# Altium schematic sheet Lights.SchDoc: RGB LEDS
size Letter; Author: Parth Thakkar; CompanyName: Insane Corp; DrawnBy: Parth Thakkar; Engineer: Parth Thakkar; Organization: Low Self Esteem; Revision: v1.0; SheetNumber: 8; SheetTotal: 8
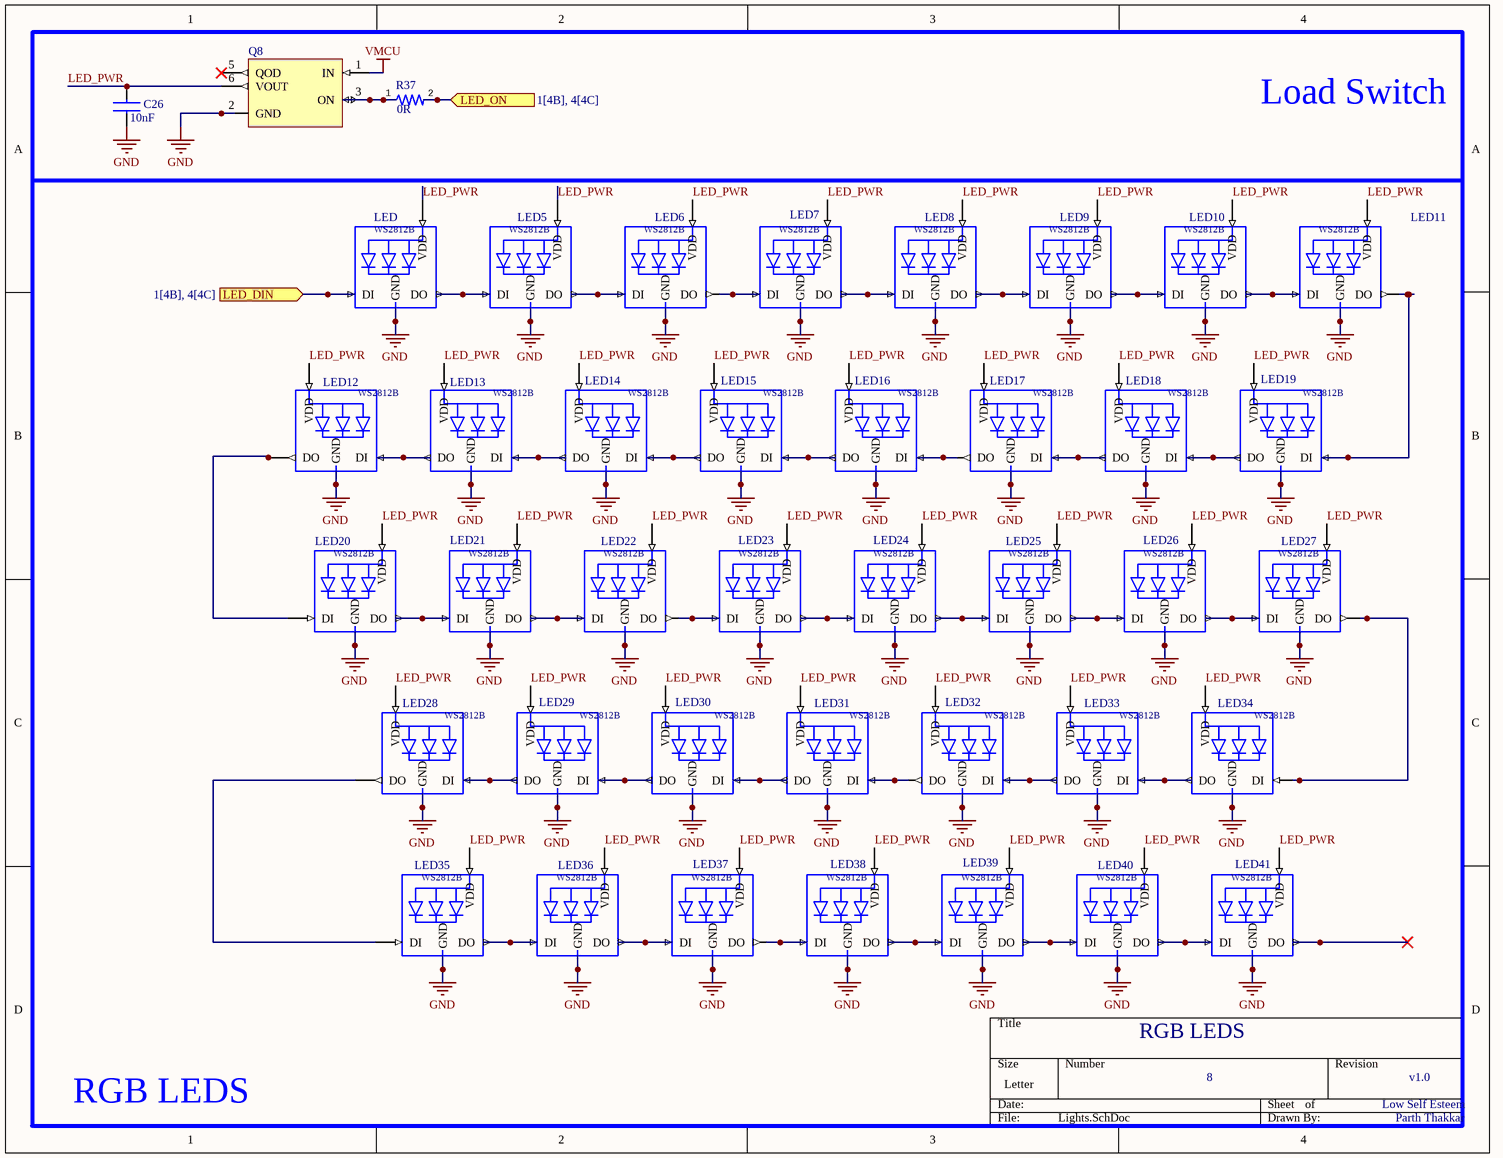
[diagram p0: Lights.SchDoc]

## Parts
C26  value 10nF  [Capacitor 0603]  (hidden comment: CAP 0.1uF 100V 0603)
LED  WS2812B  [WS2812B]  (value not drawn)
LED5  WS2812B  [WS2812B]  (value not drawn)
LED6  WS2812B  [WS2812B]  (value not drawn)
LED7  WS2812B  [WS2812B]  (value not drawn)
LED8  WS2812B  [WS2812B]  (value not drawn)
LED9  WS2812B  [WS2812B]  (value not drawn)
LED10  WS2812B  [WS2812B]  (value not drawn)
LED11  WS2812B  [WS2812B]  (value not drawn)
LED12  WS2812B  [WS2812B]  (value not drawn)
LED13  WS2812B  [WS2812B]  (value not drawn)
LED14  WS2812B  [WS2812B]  (value not drawn)
LED15  WS2812B  [WS2812B]  (value not drawn)
LED16  WS2812B  [WS2812B]  (value not drawn)
LED17  WS2812B  [WS2812B]  (value not drawn)
LED18  WS2812B  [WS2812B]  (value not drawn)
LED19  WS2812B  [WS2812B]  (value not drawn)
LED20  WS2812B  [WS2812B]  (value not drawn)
LED21  WS2812B  [WS2812B]  (value not drawn)
LED22  WS2812B  [WS2812B]  (value not drawn)
LED23  WS2812B  [WS2812B]  (value not drawn)
LED24  WS2812B  [WS2812B]  (value not drawn)
LED25  WS2812B  [WS2812B]  (value not drawn)
LED26  WS2812B  [WS2812B]  (value not drawn)
LED27  WS2812B  [WS2812B]  (value not drawn)
LED28  WS2812B  [WS2812B]  (value not drawn)
LED29  WS2812B  [WS2812B]  (value not drawn)
LED30  WS2812B  [WS2812B]  (value not drawn)
LED31  WS2812B  [WS2812B]  (value not drawn)
LED32  WS2812B  [WS2812B]  (value not drawn)
LED33  WS2812B  [WS2812B]  (value not drawn)
LED34  WS2812B  [WS2812B]  (value not drawn)
LED35  WS2812B  [WS2812B]  (value not drawn)
LED36  WS2812B  [WS2812B]  (value not drawn)
LED37  WS2812B  [WS2812B]  (value not drawn)
LED38  WS2812B  [WS2812B]  (value not drawn)
LED39  WS2812B  [WS2812B]  (value not drawn)
LED40  WS2812B  [WS2812B]  (value not drawn)
LED41  WS2812B  [WS2812B]  (value not drawn)
Q8  TPS22919  [TPS22919DCKR - Load SW]  (value not drawn)
R37  value 0R  [Resistor 0402]  (hidden comment: RES 0R 0402)

## Blocks framed on the sheet
RGB LEDS: LED LED5-LED41

## Ports
LED_DIN (in, see 1[4B], 4[4C]), LED_ON (in, see 1[4B], 4[4C])

## Nets
GND: C26.1 LED.3-GND(GND) LED5.3-GND(GND) LED6.3-GND(GND) LED7.3-GND(GND) LED8.3-GND(GND) LED9.3-GND(GND) LED10.3-GND(GND) LED11.3-GND(GND) LED12.3-GND(GND) LED13.3-GND(GND) LED14.3-GND(GND) LED15.3-GND(GND) LED16.3-GND(GND) LED17.3-GND(GND) LED18.3-GND(GND) LED19.3-GND(GND) LED20.3-GND(GND) LED21.3-GND(GND) LED22.3-GND(GND) LED23.3-GND(GND) LED24.3-GND(GND) LED25.3-GND(GND) LED26.3-GND(GND) LED27.3-GND(GND) LED28.3-GND(GND) LED29.3-GND(GND) LED30.3-GND(GND) LED31.3-GND(GND) LED32.3-GND(GND) LED33.3-GND(GND) LED34.3-GND(GND) LED35.3-GND(GND) LED36.3-GND(GND) LED37.3-GND(GND) LED38.3-GND(GND) LED39.3-GND(GND) LED40.3-GND(GND) LED41.3-GND(GND) Q8.2(GND)
VMCU: Q8.1(IN)
LED_DIN: LED.4-DIN(DI) ; port LED_DIN
LED_ON: R37.2 ; port LED_ON
LED_PWR: C26.2 LED.1-VDD(VDD) LED5.1-VDD(VDD) LED6.1-VDD(VDD) LED7.1-VDD(VDD) LED8.1-VDD(VDD) LED9.1-VDD(VDD) LED10.1-VDD(VDD) LED11.1-VDD(VDD) LED12.1-VDD(VDD) LED13.1-VDD(VDD) LED14.1-VDD(VDD) LED15.1-VDD(VDD) LED16.1-VDD(VDD) LED17.1-VDD(VDD) LED18.1-VDD(VDD) LED19.1-VDD(VDD) LED20.1-VDD(VDD) LED21.1-VDD(VDD) LED22.1-VDD(VDD) LED23.1-VDD(VDD) LED24.1-VDD(VDD) LED25.1-VDD(VDD) LED26.1-VDD(VDD) LED27.1-VDD(VDD) LED28.1-VDD(VDD) LED29.1-VDD(VDD) LED30.1-VDD(VDD) LED31.1-VDD(VDD) LED32.1-VDD(VDD) LED33.1-VDD(VDD) LED34.1-VDD(VDD) LED35.1-VDD(VDD) LED36.1-VDD(VDD) LED37.1-VDD(VDD) LED38.1-VDD(VDD) LED39.1-VDD(VDD) LED40.1-VDD(VDD) LED41.1-VDD(VDD) Q8.6(VOUT)
NetLED5_2-DOUT: LED5.2-DOUT(DO) LED6.4-DIN(DI)
NetLED6_2-DOUT: LED6.2-DOUT(DO) LED7.4-DIN(DI)
NetLED7_2-DOUT: LED7.2-DOUT(DO) LED8.4-DIN(DI)
NetLED8_2-DOUT: LED8.2-DOUT(DO) LED9.4-DIN(DI)
NetLED9_2-DOUT: LED9.2-DOUT(DO) LED10.4-DIN(DI)
NetLED10_2-DOUT: LED10.2-DOUT(DO) LED11.4-DIN(DI)
NetLED11_2-DOUT: LED11.2-DOUT(DO) LED19.4-DIN(DI)
NetLED12_2-DOUT: LED12.2-DOUT(DO) LED20.4-DIN(DI)
NetLED12_4-DIN: LED12.4-DIN(DI) LED13.2-DOUT(DO)
NetLED13_4-DIN: LED13.4-DIN(DI) LED14.2-DOUT(DO)
NetLED14_4-DIN: LED14.4-DIN(DI) LED15.2-DOUT(DO)
NetLED15_4-DIN: LED15.4-DIN(DI) LED16.2-DOUT(DO)
NetLED16_4-DIN: LED16.4-DIN(DI) LED17.2-DOUT(DO)
NetLED17_4-DIN: LED17.4-DIN(DI) LED18.2-DOUT(DO)
NetLED18_4-DIN: LED18.4-DIN(DI) LED19.2-DOUT(DO)
NetLED20_2-DOUT: LED20.2-DOUT(DO) LED21.4-DIN(DI)
NetLED21_2-DOUT: LED21.2-DOUT(DO) LED22.4-DIN(DI)
NetLED22_2-DOUT: LED22.2-DOUT(DO) LED23.4-DIN(DI)
NetLED23_2-DOUT: LED23.2-DOUT(DO) LED24.4-DIN(DI)
NetLED24_2-DOUT: LED24.2-DOUT(DO) LED25.4-DIN(DI)
NetLED25_2-DOUT: LED25.2-DOUT(DO) LED26.4-DIN(DI)
NetLED26_2-DOUT: LED26.2-DOUT(DO) LED27.4-DIN(DI)
NetLED27_2-DOUT: LED27.2-DOUT(DO) LED34.4-DIN(DI)
NetLED28_2-DOUT: LED28.2-DOUT(DO) LED35.4-DIN(DI)
NetLED28_4-DIN: LED28.4-DIN(DI) LED29.2-DOUT(DO)
NetLED29_4-DIN: LED29.4-DIN(DI) LED30.2-DOUT(DO)
NetLED30_4-DIN: LED30.4-DIN(DI) LED31.2-DOUT(DO)
NetLED31_4-DIN: LED31.4-DIN(DI) LED32.2-DOUT(DO)
NetLED32_4-DIN: LED32.4-DIN(DI) LED33.2-DOUT(DO)
NetLED33_4-DIN: LED33.4-DIN(DI) LED34.2-DOUT(DO)
NetLED35_2-DOUT: LED35.2-DOUT(DO) LED36.4-DIN(DI)
NetLED36_2-DOUT: LED36.2-DOUT(DO) LED37.4-DIN(DI)
NetLED37_2-DOUT: LED37.2-DOUT(DO) LED38.4-DIN(DI)
NetLED38_2-DOUT: LED38.2-DOUT(DO) LED39.4-DIN(DI)
NetLED39_2-DOUT: LED39.2-DOUT(DO) LED40.4-DIN(DI)
NetLED40_2-DOUT: LED40.2-DOUT(DO) LED41.4-DIN(DI)
NetLED_2-DOUT: LED.2-DOUT(DO) LED5.4-DIN(DI)
NetQ8_3: Q8.3(ON) R37.1

Not connected (* = marked no-connect by the designer): LED41 2-DOUT(DO)*; Q8 5(QOD)*

## Notes on the sheet
- Load Switch

## Library data of the parts
C26 = CAP 0.1uF 100V 0603: Ceramic Capacitor, Multilayer, Ceramic, 100V, 10% +Tol, 10% -Tol, X7R, 15% TC, 0.01uF, Surface Mount, 0603; Manufacturer: Murata; Manufacturer Part Number: GCM188R72A103KA37D; Multilayer: Yes; Reference Standard: AEC-Q200; Supplier: Digikey; Supplier Part Number: 490-4781-2-ND; RoHS: Yes; Category: Ceramic Capacitors; Stock: 6260000; Pricing: 4000=0.00978, 8000=0.00881, 12000=0.00833, 20000=0.00779, 28000=0.00747, 40000=0.00716, 100000=0.0065, 200000=0.00638 (USD); Mounting Technology: Surface Mount; Pins: 2; Dielectric Material: Ceramic; Package Shape: Rectangular; Case/Package: 0603; Terminal Finish: Nickel; Min Operating Temperature: -55°C; Max Operating Temperature: 125°C; JESD-609 Code: e3; Capacitor Type: Ceramic; Tolerance  (fill in as +-): 10%; Package Style: SMTMeter; Packaging: Tape and Reel; Tolerance (fill in as +-): 10%; Rated DC Voltage (URdc): 100V; Temperature Characteristics Code: X7R; Termination: Wraparound; Length: 1.6mm; Width: 0.8mm; Height: 0.9mm; Reach SVHC Compliant: Yes; RoHS Compliant: Yes; ComponentLink1URL: https://psearch.en.murata.com:443/capacitor/product/GCM188R72A103KA37%23.pdf?src-supplier=IHS+Markit; ComponentLink1Description: https://psearch.en.murata.com:443/capacitor/product/GCM188R72A103KA37%23.pdf?src-supplier=IHS+Markit; ComponentLink2URL: https://datasheet.ciiva.com/132/product-132907.pdf?src-supplier=Digikey; ComponentLink2Description: https://datasheet.ciiva.com/132/product-132907.pdf?src-supplier=Digikey; ComponentLink3URL: https://datasheet.ciiva.com/132/product-132908.pdf?src-supplier=Digikey; ComponentLink3Description: https://datasheet.ciiva.com/132/product-132908.pdf?src-supplier=Digikey; ComponentLink4URL: https://datasheet.ciiva.com/132/product-132909.pdf?src-supplier=Digikey; ComponentLink4Description: https://datasheet.ciiva.com/132/product-132909.pdf?src-supplier=Digikey; ComponentLink5URL: https://datasheet.ciiva.com/11786/0900766b80ef92d0-11786108.pdf?src-supplier=Rs; ComponentLink5Description: https://datasheet.ciiva.com/11786/0900766b80ef92d0-11786108.pdf?src-supplier=Rs; ComponentLink6URL: https://datasheet.ciiva.com/16497/product-16497251.pdf?src-supplier=Future+Electronics; ComponentLink6Description: https://datasheet.ciiva.com/16497/product-16497251.pdf?src-supplier=Future+Electronics; ComponentLink7URL: https://datasheet.ciiva.com/18183/getdatasheetpartid-178890-18183651.pdf?src-supplier=Verical; ComponentLink7Description: https://datasheet.ciiva.com/18183/getdatasheetpartid-178890-18183651.pdf?src-supplier=Verical; ComponentLink8URL: https://datasheet.ciiva.com/11619/product-11619719.pdf?src-supplier=Avnet; ComponentLink8Description: https://datasheet.ciiva.com/11619/product-11619719.pdf?src-supplier=Avnet
LED LED5-LED41 = WS2812B: Raspberry Pi HAT _40 pin_ Wheeled Robotics Kit; MF: SparkFun Electronics; Availability: Unavailable; SnapEDA_Link: https://www.snapeda.com/parts/WS2812B/Worldsemi/view-part/1038297/?ref=snap; MP: WS2812B; Price: None; Value: *; Package: None
Q8 = TPS22919: Buffer/Inverter Based Peripheral Driver, 3A, PDSO6; Manufacturer: Texas Instruments; Manufacturer Part Number: TPS22919DCKT; Supplier: Mouser; Supplier Part Number: 595-TPS22919DCKT; RoHS: Yes; Category: Power Management ICs; Stock: 6490; Pricing: 1=0.94, 10=0.712, 50=0.712, 100=0.413, 1000=0.308, 10000=0.308 (USD); ComponentLink1URL: https://www.ti.com:443/lit/ds/symlink/tps22919.pdf?src-supplier=IHS+Markit; ComponentLink1Description: https://www.ti.com:443/lit/ds/symlink/tps22919.pdf?src-supplier=IHS+Markit; ComponentLink2URL: http://www.ti.com/general/docs/suppproductinfo.tsp?distId=10&amp;gotoUrl=http%3A%2F%2Fwww.ti.com%2Flit%2Fgpn%2Ftps22919&src-supplier=Digikey; ComponentLink2Description: http://www.ti.com/general/docs/suppproductinfo.tsp?distId=10&amp;gotoUrl=http%3A%2F%2Fwww.ti.com%2Flit%2Fgpn%2Ftps22919&src-supplier=Digikey
R37 = RES 0R 0402: Metal Glaze/thick Film, 0.0625W, 0ohm, Surface Mount, 0402; Manufacturer: Yageo; Manufacturer Part Number: RC0402JR-070RL; Power: 62.5mW; Rated Temperature: 70°C; Package Height: 0.35mm; Package Length: 1mm; Package Width: 0.5mm; Supplier: Digikey; Supplier Part Number: 311-0.0JRCT-ND; RoHS: Yes; Category: Chip SMD Resistors; Stock: 15179907; Pricing: 1=0.1, 10=0.011, 25=0.0084, 50=0.0064, 100=0.0045, 250=0.00364, 500=0.0029, 1000=0.00214, 5000=0.00154, 10000=0.00133, 30000=0.00117, 50000=0.00107, 100000=0.00105 (USD); Mounting Technology: Surface Mount; Pins: 2; Package Shape: Rectangular; Case/Package: 0402; Terminal Finish: Nickel; Min Operating Temperature: -55°C; Max Operating Temperature: 155°C; JESD-609 Code: e3; Resistor Type: FIXED RESISTOR; Construction: Chip; Package Style: SMTMeter; Packaging: Tape and Reel; Technology: METAL GLAZE/THICK FILM; Termination: Wraparound; Reach SVHC Compliant: Yes; RoHS Compliant: Yes; ComponentLink1URL: https://datasheet.ciiva.com:443/pdfs/VipMasterIC/IC/YAGO/YAGO-S-A0008145938/YAGO-S-A0008145938-1.pdf?src-supplier=IHS+Markit; ComponentLink1Description: https://datasheet.ciiva.com:443/pdfs/VipMasterIC/IC/YAGO/YAGO-S-A0008145938/YAGO-S-A0008145938-1.pdf?src-supplier=IHS+Markit; ComponentLink2URL: https://datasheet.ciiva.com/2452/pyu-rc0402-51-rohs-l-6-2452608.pdf?src-supplier=Digikey; ComponentLink2Description: https://datasheet.ciiva.com/2452/pyu-rc0402-51-rohs-l-6-2452608.pdf?src-supplier=Digikey; ComponentLink3URL: https://datasheet.ciiva.com/11808/0900766b80c66297-11808195.pdf?src-supplier=Rs; ComponentLink3Description: https://datasheet.ciiva.com/11808/0900766b80c66297-11808195.pdf?src-supplier=Rs; ComponentLink4URL: https://datasheet.ciiva.com/2452/pyu-r-int-thick-7-2452609.pdf?src-supplier=Digikey; ComponentLink4Description: https://datasheet.ciiva.com/2452/pyu-r-int-thick-7-2452609.pdf?src-supplier=Digikey; ComponentLink5URL: https://datasheet.ciiva.com/2452/pyu-r-int-thick-7-2452610.pdf?src-supplier=Digikey; ComponentLink5Description: https://datasheet.ciiva.com/2452/pyu-r-int-thick-7-2452610.pdf?src-supplier=Digikey; ComponentLink6URL: https://datasheet.ciiva.com/8896/pyu-rc0402-51-rohs-l-6-8896201.pdf?src-supplier=Avnet; ComponentLink6Description: https://datasheet.ciiva.com/8896/pyu-rc0402-51-rohs-l-6-8896201.pdf?src-supplier=Avnet; ComponentLink7URL: https://datasheet.ciiva.com/7983/1018594-7983535.pdf?src-supplier=Element14; ComponentLink7Description: https://datasheet.ciiva.com/7983/1018594-7983535.pdf?src-supplier=Element14; ComponentLink8URL: https://datasheet.ciiva.com/22747/1018594-22747515.pdf?src-supplier=Element14; ComponentLink8Description: https://datasheet.ciiva.com/22747/1018594-22747515.pdf?src-supplier=Element14